# Altium project Adapter_M2_B+M_to_E.PrjPcb
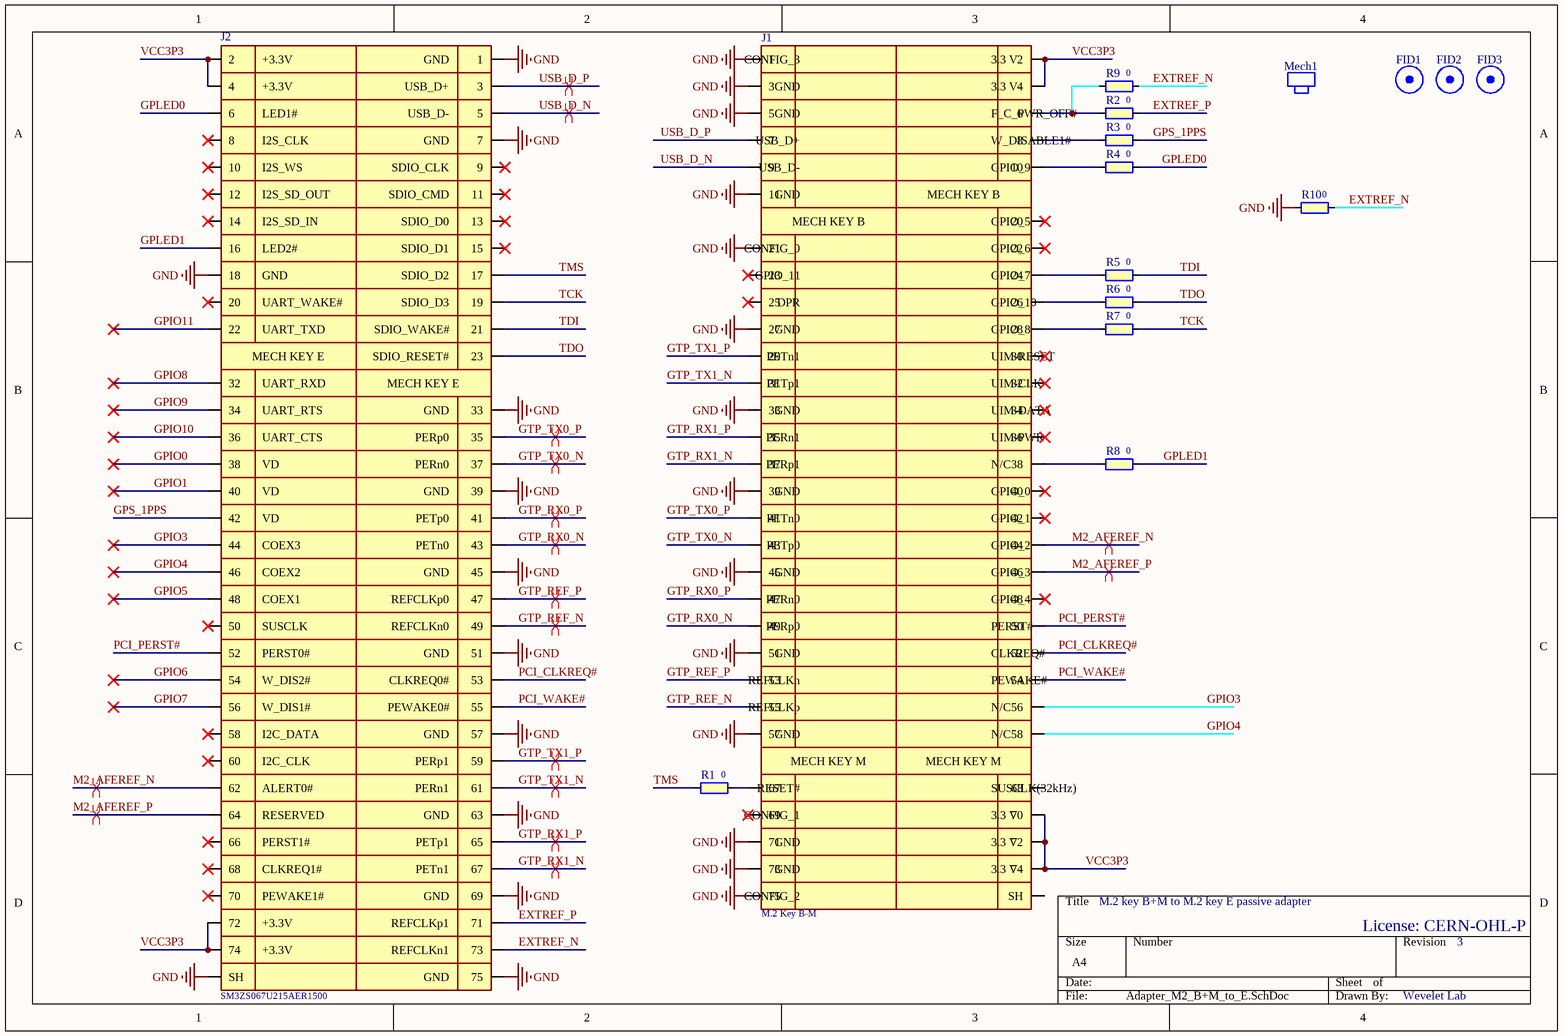
[diagram p0: Adapter_M2_B+M_to_E.SchDoc]
Revision: REV.0
1 sheet, 16 parts. Net scope: global (net labels, ports and power ports of the same name join across sheets).
Board file: Adapter_M2_B+M_to_E.PcbDoc

## Sheet Adapter_M2_B+M_to_E.SchDoc
size A4; SheetNumber: 1; SheetTotal: 1

### Parts
FID1  Fiducial  [Fiducial_2D]  (value not drawn)  (no BOM)
FID2  Fiducial  [Fiducial_2D]  (value not drawn)  (no BOM)
FID3  Fiducial  [Fiducial_2D]  (value not drawn)  (no BOM)
J1  value M.2 Key B-M  [EDGE_CONN_M.2_KEY_B-M]  (hidden comment: Edge connector M.2 B-M)  (no BOM)
J2  SM3ZS067U215AER1500  [JAE_SM3ZS067U215AER1500]
Mech1  SM3ZS067U215-NUT1-R2500  [JAE_SM3ZS067U215-NUT1]  (value not drawn)
R1  value 0  [RESC60X30X35L15N]  (hidden comment: Res-0201-0-5%)
R2  value 0  [RESC60X30X35L15N]  (hidden comment: Res-0201-0-5%)
R3  value 0  [RESC60X30X35L15N]  (hidden comment: Res-0201-0-5%)
R4  value 0  [RESC60X30X35L15N]  (hidden comment: Res-0201-0-5%)
R5  value 0  [RESC60X30X35L15N]  (hidden comment: Res-0201-0-5%)
R6  value 0  [RESC60X30X35L15N]  (hidden comment: Res-0201-0-5%)
R7  value 0  [RESC60X30X35L15N]  (hidden comment: Res-0201-0-5%)
R8  value 0  [RESC60X30X35L15N]  (hidden comment: Res-0201-0-5%)
R9  value 0  [RESC60X30X35L15N]  (hidden comment: Res-0201-0-5%)
R10  value 0  [RESC60X30X35L15N]  (hidden comment: Res-0201-0-5%)

### Nets
GND: J1.1 J1.3 J1.5 J1.11 J1.21 J1.27 J1.33 J1.39 J1.45 J1.51 J1.57 J1.71 J1.73 J1.75 J2.1 J2.7 J2.18 J2.33 J2.39 J2.45 J2.51 J2.57 J2.63 J2.69 J2.75 J2.SH R10.1
EXTREF_N: J2.73 R9.2 R10.2
EXTREF_P: J2.71 R2.2
GPIO0: J2.38
GPIO1: J2.40
GPIO3: J1.56 J2.44
GPIO4: J1.58 J2.46
GPIO5: J2.48
GPIO6: J2.54
GPIO7: J2.56
GPIO8: J2.32
GPIO9: J2.34
GPIO10: J2.36
GPIO11: J2.22
GPLED0: J2.6 R4.2
GPLED1: J2.16 R8.2
GPS_1PPS: J2.42 R3.2
GTP_REF_N: J1.55 J2.49
GTP_REF_P: J1.53 J2.47
GTP_RX0_N: J1.49 J2.43
GTP_RX0_P: J1.47 J2.41
GTP_RX1_N: J1.37 J2.67
GTP_RX1_P: J1.35 J2.65
GTP_TX0_N: J1.43 J2.37
GTP_TX0_P: J1.41 J2.35
GTP_TX1_N: J1.31 J2.61
GTP_TX1_P: J1.29 J2.59
M2_AFEREF_N: J1.44 J2.62
M2_AFEREF_P: J1.46 J2.64
PCI_CLKREQ#: J1.52 J2.53
PCI_PERST#: J1.50 J2.52
PCI_WAKE#: J1.54 J2.55
TCK: J2.19 R7.2
TDI: J2.21 R5.2
TDO: J2.23 R6.2
TMS: J2.17 R1.1
USB_D_N: J1.9 J2.5
USB_D_P: J1.7 J2.3
VCC3P3: J1.2 J1.4 J1.70 J1.72 J1.74 J2.2 J2.4 J2.72 J2.74
NetJ1_6: J1.6 R2.1 R9.1
NetJ1_8: J1.8 R3.1
NetJ1_10: J1.10 R4.1
NetJ1_24: J1.24 R5.1
NetJ1_26: J1.26 R6.1
NetJ1_28: J1.28 R7.1
NetJ1_38: J1.38 R8.1
NetJ1_67: J1.67 R1.2

Not connected (* = marked no-connect by the designer): J1 20* 22* 23* 25* 30* 32* 34* 36* 40* 42* 48* 68 69* SH; J2 8* 9* 10* 11* 12* 13* 14* 15* 20* 50* 58* 60* 66* 68* 70*; Mech1 SH

### Layout directives
differential pair: GTP_REF_N, GTP_REF_P, GTP_RX0_N, GTP_RX0_P, GTP_RX1_N, GTP_RX1_P, GTP_TX0_N, GTP_TX0_P, GTP_TX1_N, GTP_TX1_P, M2_AFEREF_N, M2_AFEREF_P, USB_D_N, USB_D_P

### Notes on the sheet
- M.2 key B+M to M.2 key E passive adapter
- License: CERN-OHL-P
- 3
- Wevelet Lab
- (in symbol Edge connector M.2 B-M) CONFIG_3; 3.3 V; GND; F_C_PWR_OFF#; USB_D+; W_DISABLE1#; USB_D-; GPIO_9; MECH KEY B; GPIO_5; CONFIG_0; GPIO_6; GPIO_11; GPIO_7; DPR; GPIO_10; GPIO_8; PETn1; UIM-RESET; PETp1; UIM-CLK; UIM-DATA; PERn1; UIM-PWR; PERp1; N/C; GPIO_0; PETn0; GPIO_1; PETp0; GPIO_2; GPIO_3; PERn0; GPIO_4; PERp0; PERST#; CLKREQ#; REFCLKn; PEWAKE#; REFCLKp; MECH KEY M; RESET#; SUSCLK(32kHz); CONFIG_1; CONFIG_2
- (in symbol SM3ZS067U215AER1500) +3.3V; GND; USB_D+; LED1#; USB_D-; I2S_CLK; I2S_WS; SDIO_CLK; I2S_SD_OUT; SDIO_CMD; I2S_SD_IN; SDIO_D0; LED2#; SDIO_D1; SDIO_D2; UART_WAKE#; SDIO_D3; UART_TXD; SDIO_WAKE#; MECH KEY E; SDIO_RESET#; UART_RXD; UART_RTS; UART_CTS; PERp0; VD; PERn0; PETp0; COEX3; PETn0; COEX2; COEX1; REFCLKp0; SUSCLK; REFCLKn0; PERST0#; W_DIS2#; CLKREQ0#; W_DIS1#; PEWAKE0#; I2C_DATA; I2C_CLK; PERp1; ALERT0#; PERn1; RESERVED; PERST1#; PETp1; CLKREQ1#; PETn1; PEWAKE1#; REFCLKp1; REFCLKn1

### Library data of the parts
J1 = Edge connector M.2 B-M: Edge connector M.2, Key B-M; Manufacturer: *
J2 = SM3ZS067U215AER1500: Conn M.2, Key E, -40/+80, SMD; Manufacturer: JAE; Value: SM3ZS067U215AER1500
Mech1 = SM3ZS067U215-NUT1-R2500: Mech, standoff, M2, 0.35 mm; Manufacturer: JAE; Value: SM3ZS067U215-NUT1-R2500
R1-R10 = Res-0201-0-5%: Resistor, 0, 0.05W, 5%, 0201; Manufacturer: *
FID1-FID3 = Fiducial: Manufacturer: *; Value: *

## Assembly variants
CS: not fitted R1 R5 R6 R7 R10